# EAGLE design Crystal Cmoy Sch EaglePCB 1 (EAGLE 9.5.0)
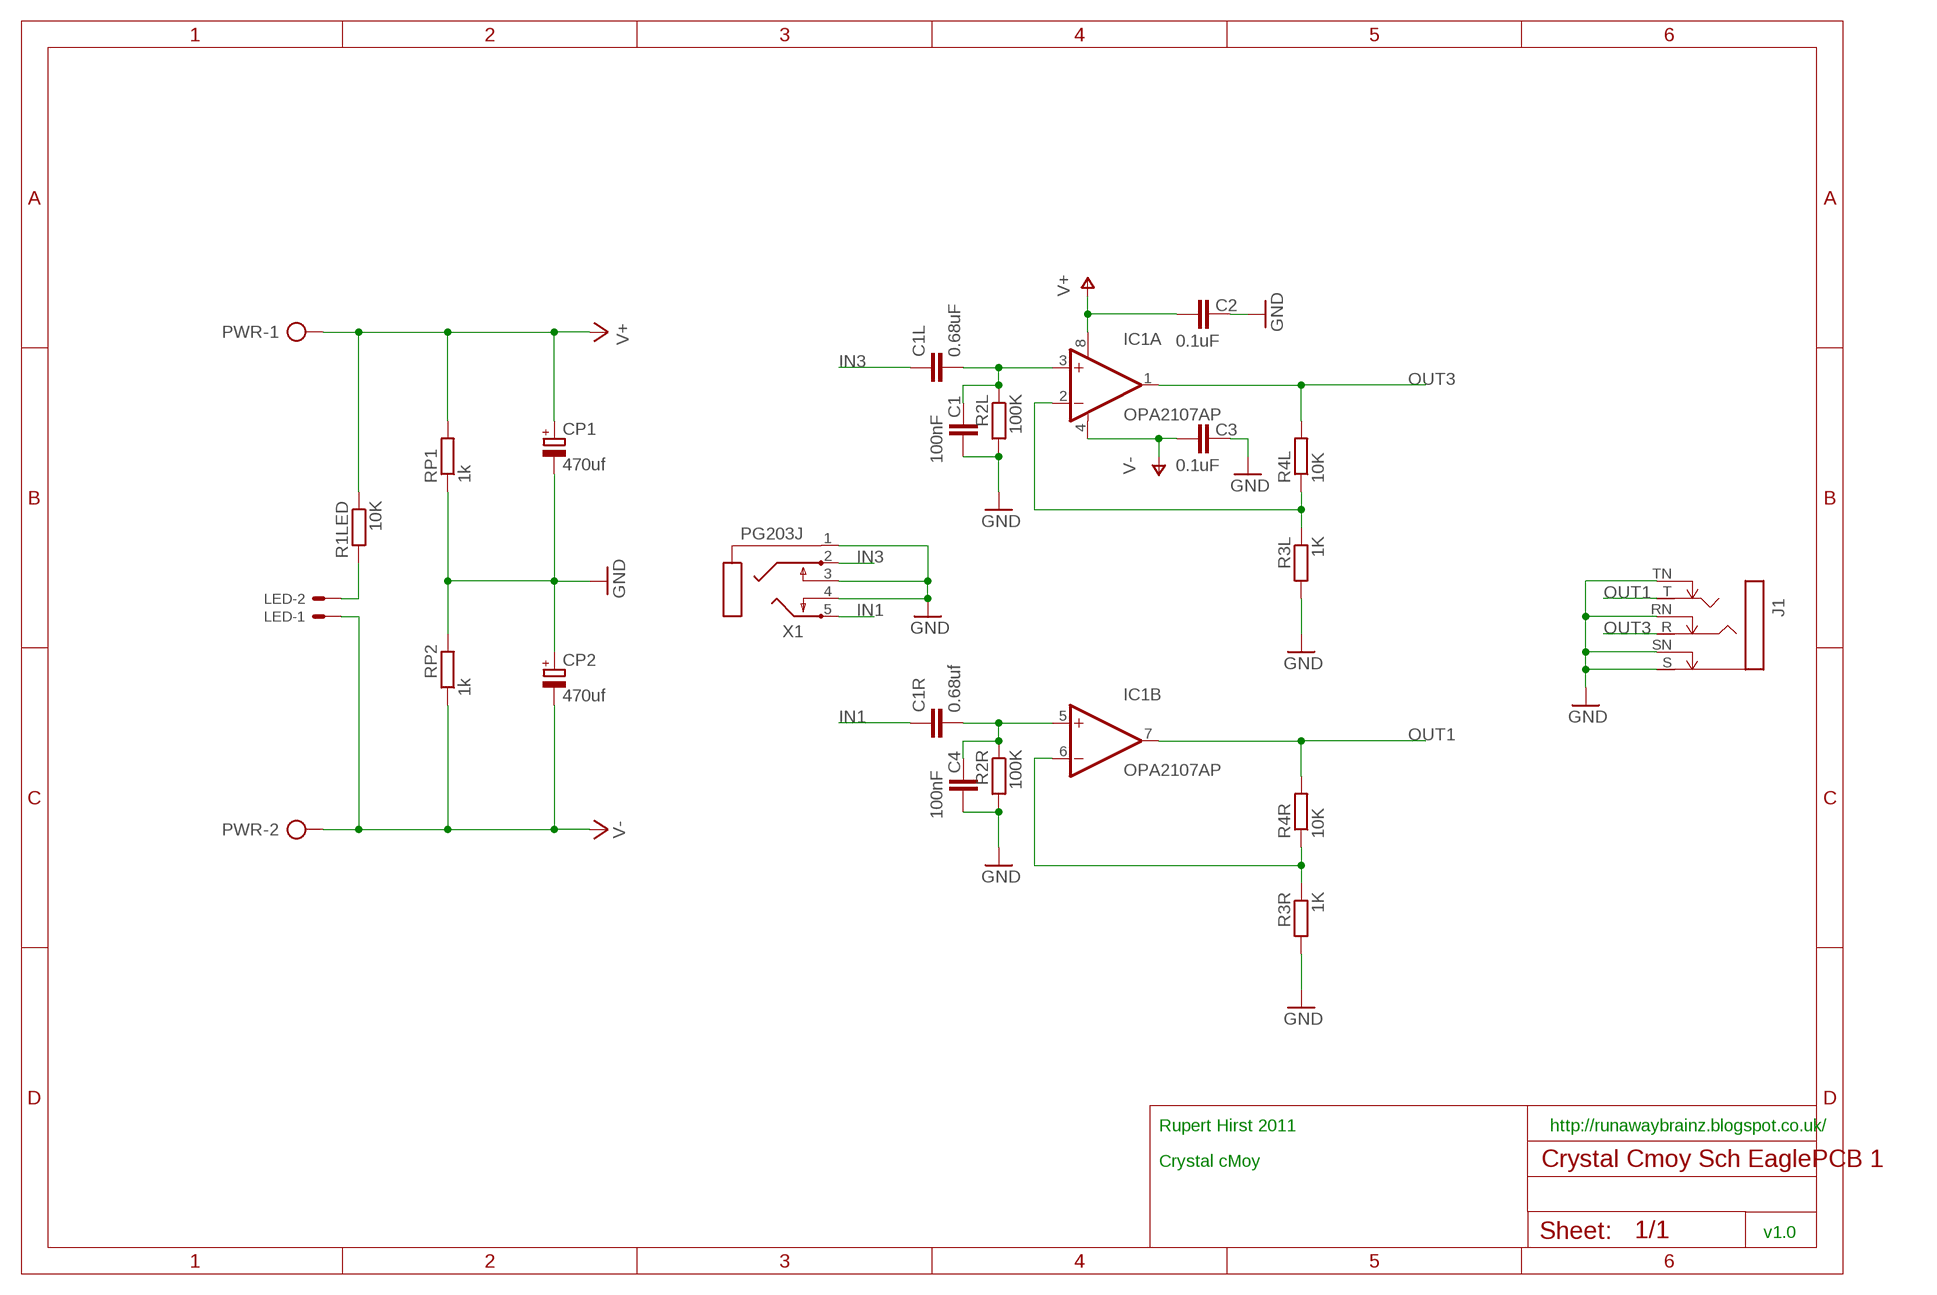
[diagram p0: schematic, sheet 1]

## Parts
C1  100nF  C-EU025-025X050  [C025-025X050]
C1L  0.68uF  C5/4.5  [C5B4.5]
C1R  0.68uf  C5/4.5  [C5B4.5]
C2  0.1uF  C5/2.5  [C5B2.5]
C3  0.1uF  C5/2.5  [C5B2.5]
C4  100nF  C-EU025-025X050  [C025-025X050]
CP1  470uf  CPOL-EUE5-13  [E5-13]
CP2  470uf  CPOL-EUE5-13  [E5-13]
IC1  OPA2107AP  OPA2132P  [DIL08]
J1  STEREOSW  [NMJ6HCD2]
LED  22-23-2021  [22-23-2021]
PWR  AK500/2  [AK500/2]
R1LED  10K  R-EU_0411/15  [0411/15]
R2L  100K  R-EU_0411/15  [0411/15]
R2R  100K  R-EU_0411/15  [0411/15]
R3L  1K  R-EU_0411/15  [0411/15]
R3R  1K  R-EU_0411/15  [0411/15]
R4L  10K  R-EU_0411/15  [0411/15]
R4R  10K  R-EU_0411/15  [0411/15]
RP1  1k  R-EU_0411/15  [0411/15]
RP2  1k  R-EU_0411/15  [0411/15]
X1  PG203J  [PG203J]

## Nets
GND: C1.2 C2.1 C3.1 C4.2 CP1.- CP2.+ J1.RN J1.S J1.SN J1.TN R2L.2 R2R.2 R3L.2 R3R.2 RP1.1 RP2.2 X1.1 X1.3 X1.4
IN1: C1R.1 X1.5
IN3: C1L.1 X1.2
N$3: IC1.2(A:-IN) R3L.1 R4L.1
N$4: C1.1 C1L.2 IC1.3(A:+IN) R2L.1
N$7: IC1.6(B:-IN) R3R.1 R4R.1
N$8: C1R.2 C4.1 IC1.5(B:+IN) R2R.1
N$14: LED.2 R1LED.2
OUT1: IC1.7(B:OUT) J1.T R4R.2
OUT3: IC1.1(A:OUT) J1.R R4L.2
V+: C2.2 CP1.+ IC1.8(A:V+) PWR.1 R1LED.1 RP1.2
V-: C3.2 CP2.- IC1.4(A:V-) LED.1 PWR.2 RP2.1

## Notes on the sheet
- Rupert Hirst 2011 | http://runawaybrainz.blogspot.co.uk/
- Crystal cMoy
- v1.0

## Library data of the parts
C1 C4 = resistor:C-EU: CAPACITOR, European symbol
C1L C1R C2 C3 = capacitor-wima:C: CAPACITOR naming: grid - package width
CP1 CP2 = rcl:CPOL-EU: POLARIZED CAPACITOR, European symbol
IC1 = burr-brown:OPA2132: High Speed FET-Input Operational Amplifiers< Product Folder:OPA2132
J1 = pl-jacks:STEREOSW
LED = con-molex:22-23-2021: .100" (2.54mm) Center Header - 2 Pin; MF: MOLEX; MPN: 22-23-2021; OC_FARNELL: 1462926; OC_NEWARK: 25C3832
PWR = con-ptr500:AK500/2: CONNECTOR; OC_FARNELL: unknown; OC_NEWARK: unknown
R1LED R2L R2R R3L R3R R4L R4R RP1 RP2 = resistor:R-EU_: RESISTOR, European symbol
X1 = con-hirschmann:PG203J: MIC/HEADPHONE JACK KS-S stereo microphone/headphone jack PG203JN (Schukat); OC_FARNELL: unknown; OC_NEWARK: unknown

## Net classes
0 default: width 1 mm, drill 1 mm, clearance 0.5 mm

## Board
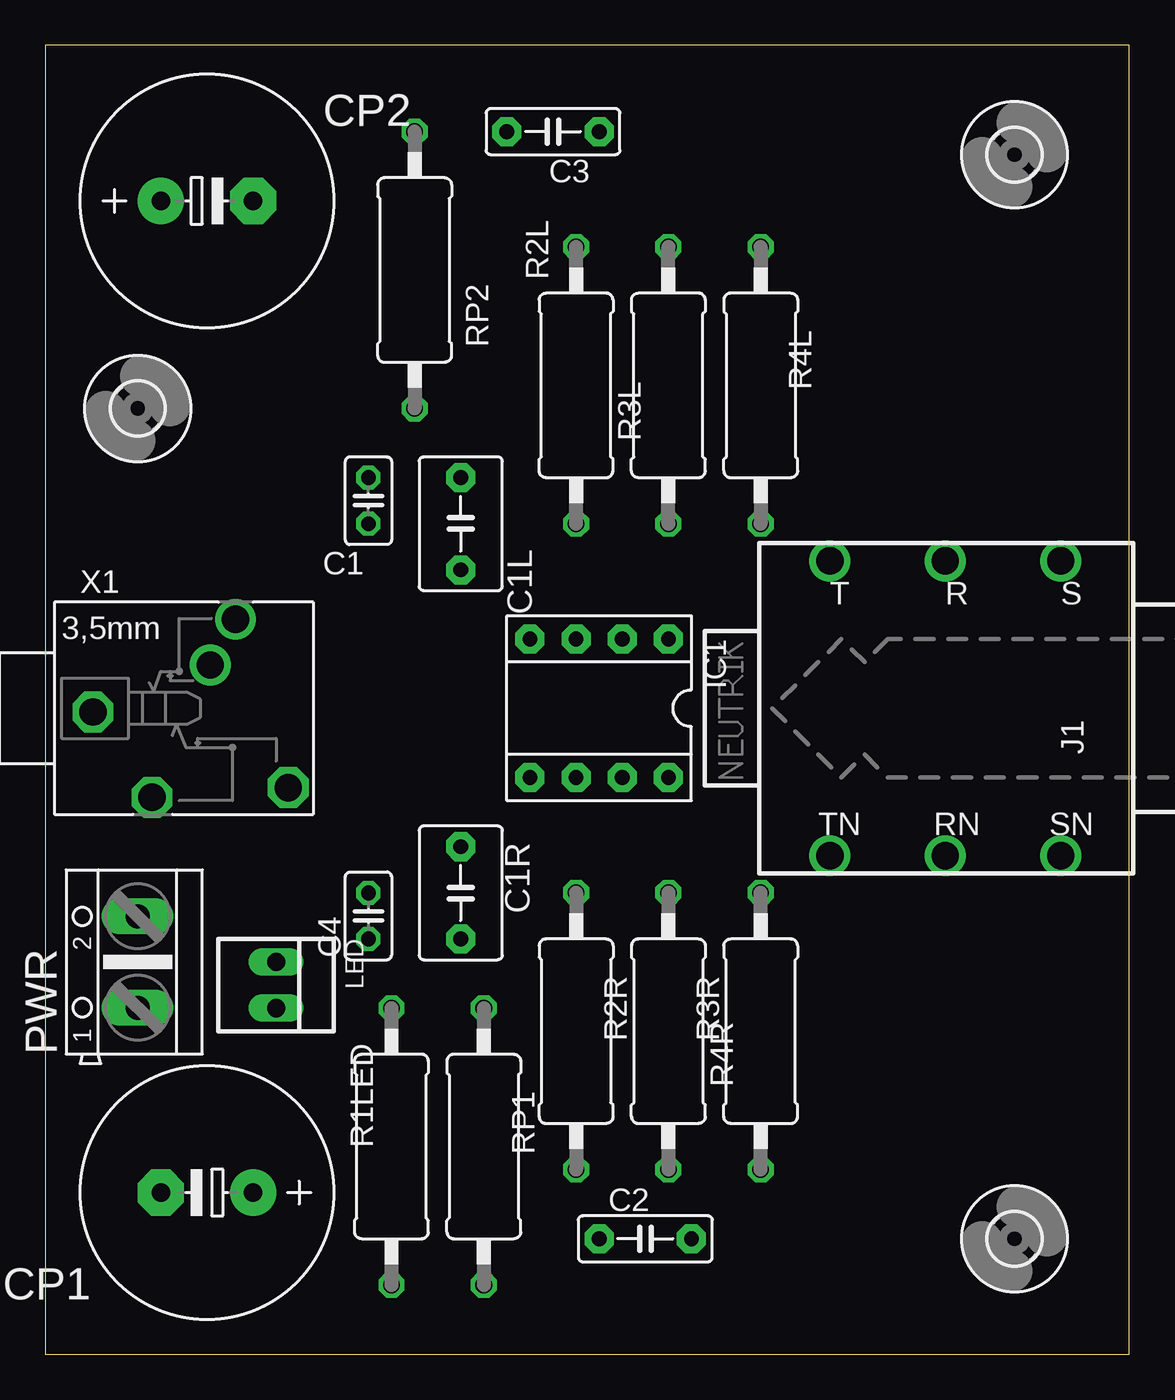
[diagram p1: board, top side]
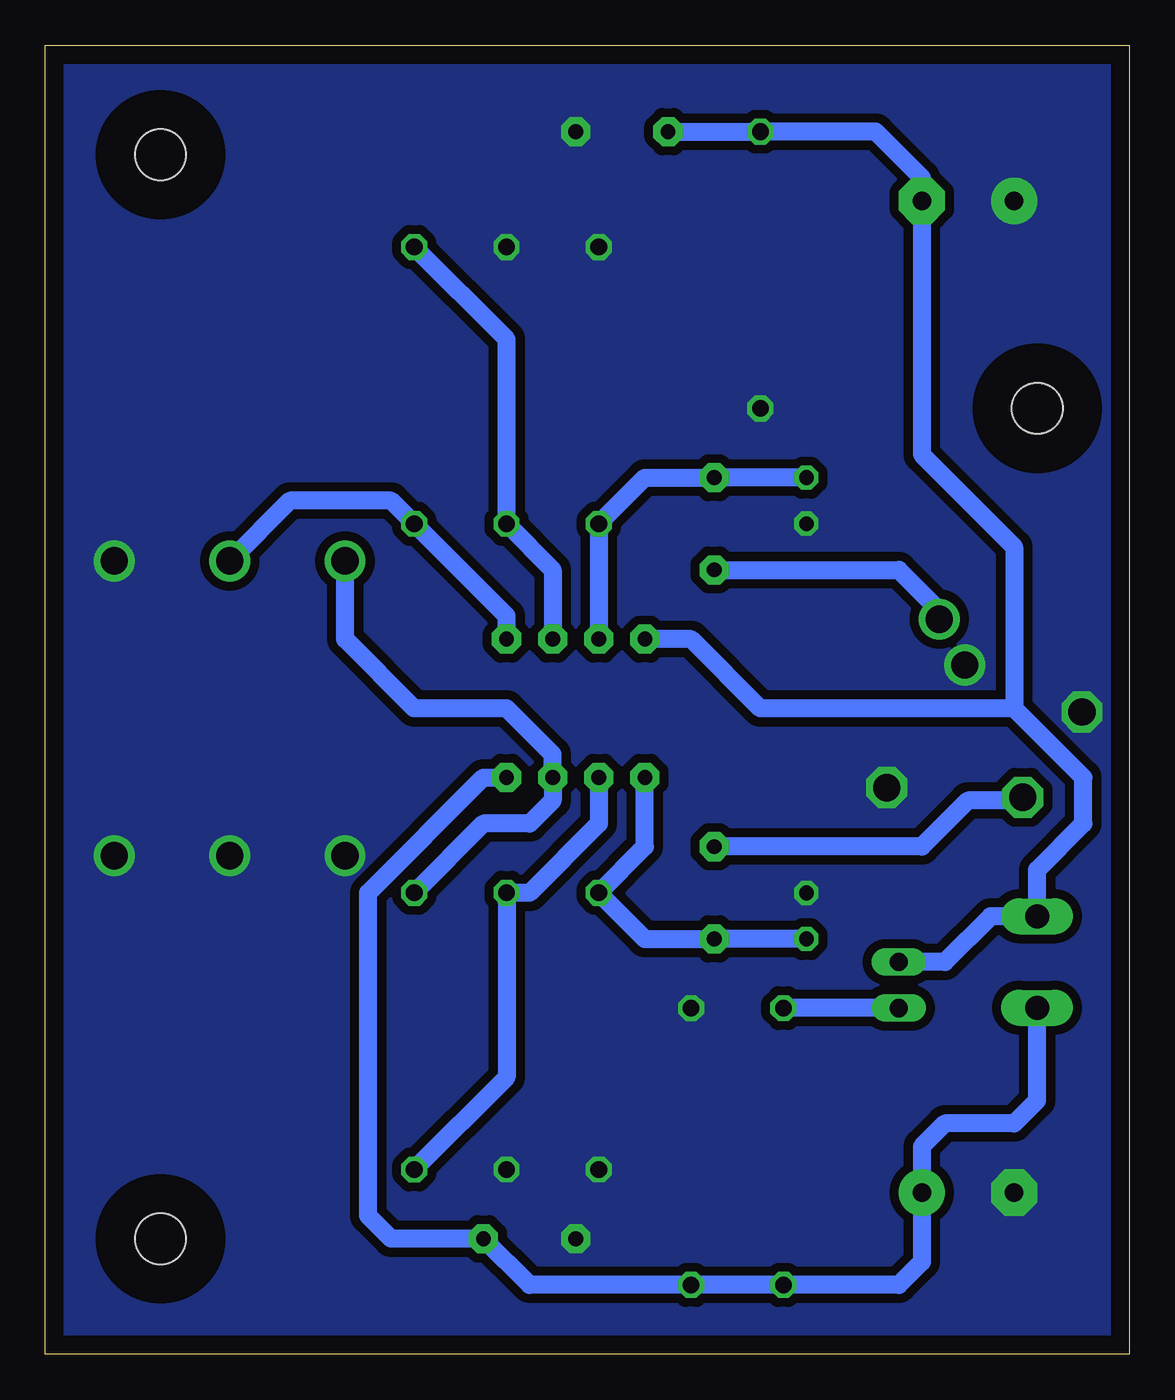
[diagram p2: board, bottom side, seen from below]

Size 59.67 x 72.06 mm. Coordinates in mm from the lower left corner, seen from the top.
Outline: 0,0 59.67,0 59.67,72.06 0,72.06 0,0
Copper layers (1*16): Top 0.035mm / dielectric 1.5mm / Bottom 0.035mm
Design rules "default *": minimum track width 6mil, minimum drill 0.35mm, track to track 6mil, track to pad 6mil, pad to pad 6mil, via to via 6mil, smd to smd 6mil, copper to edge 40mil, drill to drill 6mil, minimum pad ring 10mil, minimum via ring 8mil, stop-mask expansion 4mil, vias tented up to drill 0mil, thermal gap 0mil

### Footprints (pad centres in the part's own frame; a part is rotated, then mirrored left to right if it is on the bottom)
C025-025X050 = drill 0.813 octagon: 1 -1.27,0; 2 1.27,0
C5B4.5 = drill 0.813 pad 1.6 octagon: 1 -2.54,0; 2 2.54,0
C5B2.5 = drill 0.813 pad 1.6 octagon: 1 -2.54,0; 2 2.54,0
E5-13 = drill 1.016 pad 2.54: + -2.54,0 | drill 1.016 pad 2.54 octagon: - 2.54,0
DIL08 = drill 0.813 pad 1.6 octagon: 1 -3.81,-3.81; 2 -1.27,-3.81; 3 1.27,-3.81; 4 3.81,-3.81; 5 3.81,3.81; 6 1.27,3.81; 7 -1.27,3.81; 8 -3.81,3.81
NMJ6HCD2 = drill 1.5: R 0,8.115; RN 0,-8.115; S 6.35,8.115; SN 6.35,-8.115; T -6.35,8.115; TN -6.35,-8.115
22-23-2021 = drill 1 long: 1 -1.27,0; 2 1.27,0
AK500/2 = drill 1.321 long: 1 -2.515,0; 2 2.515,0
0411/15 = drill 0.914 octagon: 1 -7.62,0; 2 7.62,0
2,8 = hole 2.8: 0,0
PG203J = drill 1.499 octagon: 1 -5.004,-0.203; 4 5.74,-4.369; 5 -1.753,-4.902 | drill 1.499: 2 2.845,4.902; 3 1.448,2.388

### Placement (x,y rotation side)
C1  17.78,46.99 270 top
C1L  22.86,45.72 90 top
C1R  22.86,25.4 270 top
C2  33.02,6.35 0 top
C3  27.94,67.31 180 top
C4  17.78,24.13 90 top
CP1  8.89,8.89 180 top
CP2  8.89,63.5 0 top
IC1  30.48,35.56 180 top
J1  49.53,35.56 0 top
LED  12.7,20.32 270 top
PWR  5.08,21.59 90 top
R1LED  19.05,11.43 90 top
R2L  29.21,53.34 90 top
R2R  29.21,17.78 270 top
R3L  34.29,53.34 90 top
R3R  34.29,17.78 270 top
R4L  39.37,53.34 270 top
R4R  39.37,17.78 90 top
RP1  24.13,11.43 270 top
RP2  20.32,59.69 270 top
U$1  [2,8]  53.34,6.35 0 top
U$2  [2,8]  53.34,66.04 0 top
U$3  [2,8]  5.08,52.07 0 top
X1  7.62,35.56 0 top

### Tracks (layer width: path | path; a pad name or v marks a point on that pad's centre or on a via)
GND
  pour Bottom: -25.4,-17.78 175.26,-17.78 175.26,106.68 -25.4,106.68
IN1
  Bottom 1: X1.5 6.04,30.48 8.89,30.48 11.43,27.94 C1R.1
IN3
  Bottom 1: X1.2 10.46,40.95 12.7,43.18 C1L.1
N$3
  Bottom 1: IC1.2 31.75,43.18 R3L.1 34.29,55.88 R4L.1
N$4
  Bottom 1: C1.1 C1L.2 26.67,48.26 R2L.1 IC1.3
N$7
  Bottom 1: R4R.1 34.29,15.24 R3R.1 33.02,25.4 29.21,29.21 IC1.6
N$8
  Bottom 1: C4.1 C1R.2 26.67,22.86 R2R.1 26.67,27.94 IC1.5
N$14
  Bottom 1: LED.2 R1LED.2
OUT1
  Bottom 1: R4R.2 35.56,29.21 33.02,29.21 31.75,30.48 IC1.7 31.75,33.02 34.29,35.56 39.37,35.56 43.18,39.37 J1.T
OUT3
  Bottom 1: IC1.1 34.29,40.64 R4L.2 40.64,46.99 46.22,46.99 J1.R
V+
  Bottom 1: IC1.8 35.56,31.75 41.91,25.4 41.91,7.62 40.64,6.35 C2.2 33.02,3.81 RP1.2 R1LED.1 12.7,3.81 11.43,5.08 CP1.+ 11.43,11.43 10.16,12.7 6.35,12.7 5.08,13.97 PWR.1
V-
  Bottom 1: 6.35,35.56 2.54,31.75 2.54,29.21 5.08,26.67 PWR.2 7.64,24.11 10.16,21.59 LED.1 | 6.35,35.56 6.35,44.45 11.43,49.53 CP2.- 11.43,64.77 13.97,67.31 RP2.1 C3.2 | IC1.4 24.13,39.37 20.32,35.56 6.35,35.56